# EAGLE design single_button (EAGLE 7.3.0)
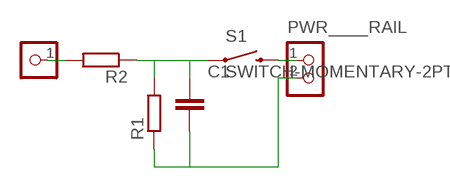
[diagram p0: schematic, sheet 1]

## Parts
C1  CAPACITOR_NPOL-0805  [C805]
PWR____RAIL  CON_HEADER_1X02-PTH  [M1X2]
R1  RESISTORR805-0805  [R805]
R2  RESISTORR805-0805  [R805]
S1  SWITCH-MOMENTARY-2PTH  [TACTILE-PTH]
SIG  CON_HEADER_1X01-PTH_08_17  [M1X2_08_17]

## Nets
GND: C1.2 PWR____RAIL.2 R1.1
N$1: C1.1 R1.2 R2.1 S1.1 S1.2
N$2: PWR____RAIL.1 S1.3 S1.4
N$4: R2.2 SIG.1

## Library data of the parts
C1 = dp_devices:CAPACITOR_NPOL: Non-Polarized capacitor in various packages
PWR____RAIL = dp_devices:CON_HEADER_1X02
R1 R2 = dp_devices:RESISTOR
S1 = SparkFun-Electromechanical:SWITCH-MOMENTARY-2: Various NO switches- pushbuttons, reed, etc
SIG = dp_devices:CON_HEADER_1X01

## Board
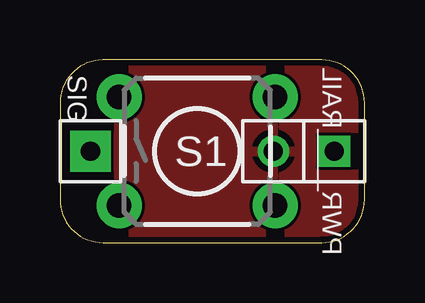
[diagram p1: board, top side]
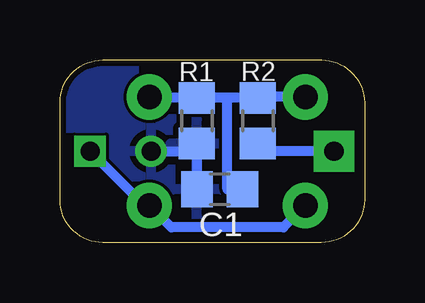
[diagram p2: board, bottom side, seen from below]

Size 12.69 x 7.61 mm. Coordinates in mm from the lower left corner, seen from the top.
Outline: 0,5.82 0,1.8 arc90 1.8,0 10.9,0 arc90 12.69,1.79 12.69,5.83 arc90 10.91,7.61 1.79,7.61 arc90 0,5.82
Copper layers (1*16): Top 0.035mm / dielectric 1.5mm / Bottom 0.035mm
Design rules "dirt_cheap_dirty_boards.v1": minimum track width 5mil, minimum drill 12mil, track to track 5mil, track to pad 5mil, pad to pad 5mil, via to via 5mil, smd to smd 0mil, copper to edge 10mil, drill to drill 10mil, minimum pad ring 10mil, minimum via ring 6mil, stop-mask expansion 2mil, vias tented up to drill 25mil, thermal gap 10mil

### Footprints (pad centres in the part's own frame; a part is rotated, then mirrored left to right if it is on the bottom)
C805 = smd 1.3 x 1.5: 1 -0.95,0; 2 0.95,0
M1X2 = drill 0.8 square: 1 -1.27,0 | drill 0.8: 2 1.27,0
R805 = smd 1.3 x 1.5: 1 -0.95,0; 2 0.95,0
TACTILE-PTH = drill 1.016 pad 1.88: 1 -3.251,2.261; 2 3.251,2.261; 3 -3.251,-2.261; 4 3.251,-2.261
M1X2_08_17 = drill 0.8 pad 1.7 square: 1 0,0

### Placement (x,y rotation side)
C1  6.03,2.22 180 bottom
PWR____RAIL  10.16,3.81 180 top
R1  6.99,5.08 90 bottom
R2  4.45,5.08 270 bottom
S1  5.71,3.81 0 top
SIG  1.27,3.81 0 top

### Tracks (layer width: path | path; a pad name or v marks a point on that pad's centre or on a via)
GND
  Bottom 0.406: C1.2 R1.1 7.3,3.81 PWR____RAIL.2
  pour Top: 0,7.62 0,0 12.7,0 12.7,7.62
  pour Bottom: 0,7.62 0,0 12.7,0 12.7,7.62
N$1
  Bottom 0.406: S1.1 4.45,6.07 R2.1 5.71,6.03 | 5.71,6.03 R1.2 8.97,6.03 S1.2 | C1.1 5.71,2.22 5.71,6.03
N$2
  Bottom 0.406: S1.3 3.38,0.64 8.05,0.64 S1.4 9.17,1.55 PWR____RAIL.1
N$4
  Bottom 0.406: SIG.1 4.45,3.81 R2.2